# Altium schematic sheet FETs.SchDoc
size 259 x 167 mm; SheetNumber: 2; SheetTotal: 8
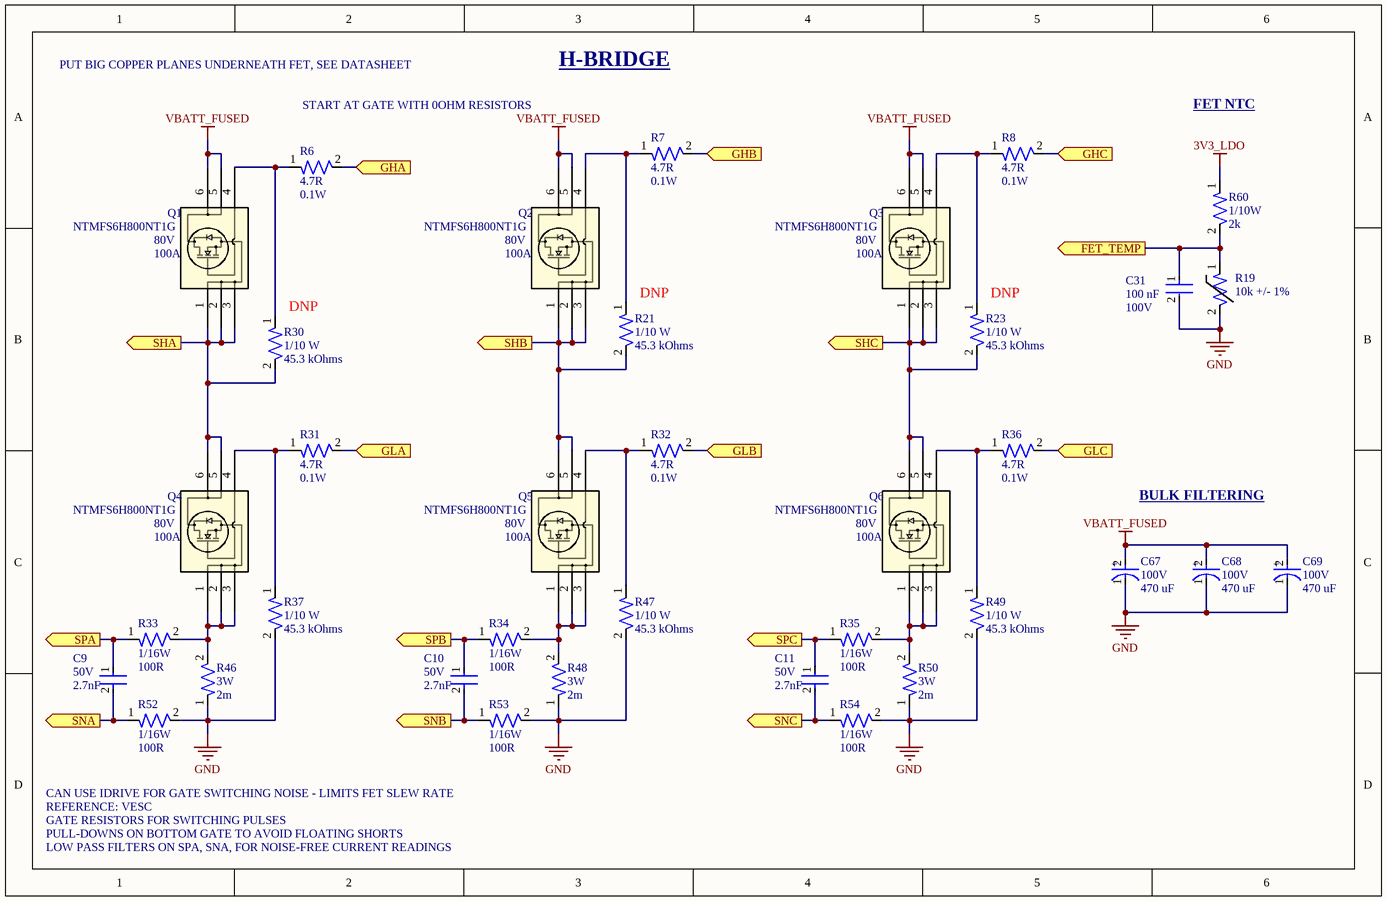
[diagram p0: FETs.SchDoc]

## Parts
C9  Voltage: 50V  Capacitance: 2.7nF  [CAP-0805]  (hidden comment: GRM2165C1H272JA01D)
C10  Voltage: 50V  Capacitance: 2.7nF  [CAP-0805]  (hidden comment: GRM2165C1H272JA01D)
C11  Voltage: 50V  Capacitance: 2.7nF  [CAP-0805]  (hidden comment: GRM2165C1H272JA01D)
C31  Capacitance: 100 nF  Voltage: 100V  [CAP-0603]  (hidden comment: GRM188R72A104KA35D)
C67  Voltage: 100V  Capacitance: 470 uF  [CAP-470U-0001]  (hidden comment: ESH477M100AM2AA)
C68  Voltage: 100V  Capacitance: 470 uF  [CAP-470U-0001]  (hidden comment: ESH477M100AM2AA)
C69  Voltage: 100V  Capacitance: 470 uF  [CAP-470U-0001]  (hidden comment: ESH477M100AM2AA)
Q1  NTMFS6H800NT1G  Vdss: 80V  Drain Current: 100A  [DFN6_5X6_SO8FL_488AA_ONS]
Q2  NTMFS6H800NT1G  Vdss: 80V  Drain Current: 100A  [DFN6_5X6_SO8FL_488AA_ONS]
Q3  NTMFS6H800NT1G  Vdss: 80V  Drain Current: 100A  [DFN6_5X6_SO8FL_488AA_ONS]
Q4  NTMFS6H800NT1G  Vdss: 80V  Drain Current: 100A  [DFN6_5X6_SO8FL_488AA_ONS]
Q5  NTMFS6H800NT1G  Vdss: 80V  Drain Current: 100A  [DFN6_5X6_SO8FL_488AA_ONS]
Q6  NTMFS6H800NT1G  Vdss: 80V  Drain Current: 100A  [DFN6_5X6_SO8FL_488AA_ONS]
R6  Resistance: 4.7R  Power: 0.1W  [RES-0603]  (hidden comment: RMCF0603FT4R70)
R7  Resistance: 4.7R  Power: 0.1W  [RES-0603]  (hidden comment: RMCF0603FT4R70)
R8  Resistance: 4.7R  Power: 0.1W  [RES-0603]  (hidden comment: RMCF0603FT4R70)
R19  Resistance: 10k +/- 1%  [RES-0603]  (hidden comment: NCU18XH103F60RB)
R21  Power: 1/10 W  Resistance: 45.3 kOhms  [RES-0603]  (hidden comment: RC0603FR-0745K3L)
R23  Power: 1/10 W  Resistance: 45.3 kOhms  [RES-0603]  (hidden comment: RC0603FR-0745K3L)
R30  Power: 1/10 W  Resistance: 45.3 kOhms  [RES-0603]  (hidden comment: RC0603FR-0745K3L)
R31  Resistance: 4.7R  Power: 0.1W  [RES-0603]  (hidden comment: RMCF0603FT4R70)
R32  Resistance: 4.7R  Power: 0.1W  [RES-0603]  (hidden comment: RMCF0603FT4R70)
R33  Power: 1/16W  Resistance: 100R  [RES-0402]  (hidden comment: RC0402FR-07100RL)
R34  Power: 1/16W  Resistance: 100R  [RES-0402]  (hidden comment: RC0402FR-07100RL)
R35  Power: 1/16W  Resistance: 100R  [RES-0402]  (hidden comment: RC0402FR-07100RL)
R36  Resistance: 4.7R  Power: 0.1W  [RES-0603]  (hidden comment: RMCF0603FT4R70)
R37  Power: 1/10 W  Resistance: 45.3 kOhms  [RES-0603]  (hidden comment: RC0603FR-0745K3L)
R46  Power: 3W  Resistance: 2m  [STA_CSNL25122_STP]  (hidden comment: CSNL2512FT2L00)
R47  Power: 1/10 W  Resistance: 45.3 kOhms  [RES-0603]  (hidden comment: RC0603FR-0745K3L)
R48  Power: 3W  Resistance: 2m  [STA_CSNL25122_STP]  (hidden comment: CSNL2512FT2L00)
R49  Power: 1/10 W  Resistance: 45.3 kOhms  [RES-0603]  (hidden comment: RC0603FR-0745K3L)
R50  Power: 3W  Resistance: 2m  [STA_CSNL25122_STP]  (hidden comment: CSNL2512FT2L00)
R52  Power: 1/16W  Resistance: 100R  [RES-0402]  (hidden comment: RC0402FR-07100RL)
R53  Power: 1/16W  Resistance: 100R  [RES-0402]  (hidden comment: RC0402FR-07100RL)
R54  Power: 1/16W  Resistance: 100R  [RES-0402]  (hidden comment: RC0402FR-07100RL)
R60  Power: 1/10W  Resistance: 2k  [RES-0603]  (hidden comment: RC0603JR-072KL)

## Ports
FET_TEMP (out, see MCU[1B], MCU[4D]), GHA (in, see Driver[4C]), GHB (in, see Driver[4B]), GHC (in, see Driver[4B]), GLA (in, see Driver[4C]), GLB (in, see Driver[4B]), GLC (in, see Driver[4B]), SHA (out, see Connectors[4B], Driver[4C]), SHB (out, see Connectors[4B], Driver[4B]), SHC (out, see Connectors[4B], Driver[4B]), SNA (out, see Driver[4B]), SNB (out, see Driver[4B]), SNC (out, see Driver[4B]), SPA (out, see Driver[4B]), SPB (out, see Driver[4B]), SPC (out, see Driver[4B])

## Nets
3V3_LDO: R60.1
GND: C31.2 C67.1 C68.1 C69.1 R19.2 R37.2 R46.1 R47.2 R48.1 R49.2 R50.1 R52.2 R53.2 R54.2
VBATT_FUSED: C67.2 C68.2 C69.2 Q1.5 Q1.6 Q2.5 Q2.6 Q3.5 Q3.6
FET_TEMP: C31.1 R19.1 R60.2 ; port FET_TEMP
GHA: R6.2 ; port GHA
GHB: R7.2 ; port GHB
GHC: R8.2 ; port GHC
GLA: R31.2 ; port GLA
GLB: R32.2 ; port GLB
GLC: R36.2 ; port GLC
SHA: Q1.1 Q1.2 Q1.3 Q4.5 Q4.6 R30.2 ; port SHA
SHB: Q2.1 Q2.2 Q2.3 Q5.5 Q5.6 R21.2 ; port SHB
SHC: Q3.1 Q3.2 Q3.3 Q6.5 Q6.6 R23.2 ; port SHC
SNA: C9.2 R52.1 ; port SNA
SNB: C10.2 R53.1 ; port SNB
SNC: C11.2 R54.1 ; port SNC
SPA: C9.1 R33.1 ; port SPA
SPB: C10.1 R34.1 ; port SPB
SPC: C11.1 R35.1 ; port SPC
NetQ1_4: Q1.4 R6.1 R30.1
NetQ2_4: Q2.4 R7.1 R21.1
NetQ3_4: Q3.4 R8.1 R23.1
NetQ4_1: Q4.1 Q4.2 Q4.3 R33.2 R46.2
NetQ4_4: Q4.4 R31.1 R37.1
NetQ5_1: Q5.1 Q5.2 Q5.3 R34.2 R48.2
NetQ5_4: Q5.4 R32.1 R47.1
NetQ6_1: Q6.1 Q6.2 Q6.3 R35.2 R50.2
NetQ6_4: Q6.4 R36.1 R49.1

## Notes on the sheet
- PUT BIG COPPER PLANES UNDERNEATH FET, SEE DATASHEET
- START AT GATE WITH 0OHM RESISTORS
- H-BRIDGE
- FET NTC
- (near R30) DNP
- (near R21) DNP
- (near R23) DNP
- BULK FILTERING
- CAN USE IDRIVE FOR GATE SWITCHING NOISE - LIMITS FET SLEW RATE
- REFERENCE: VESC
- GATE RESISTORS FOR SWITCHING PULSES
- PULL-DOWNS ON BOTTOM GATE TO AVOID FLOATING SHORTS
- LOW PASS FILTERS ON SPA, SNA, FOR NOISE-FREE CURRENT READINGS
- (in symbol CAP-470U-0001) +

## Library data of the parts
C9-C11 = CAP-2.7N-0001: CAP CER 2700PF 50V C0G/NP0 0805; ComponentLink1Description: Datasheet; ComponentLink1URL: https://search.murata.co.jp/Ceramy/image/img/A01X/G101/ENG/GRM2165C1H272JA01-01.pdf; Device Class: Ceramic; Size: 0805
C31 = CAP-1U-0002: CAP CER 100NF 100V X7R 0603; Device Class: Ceramic; Size: 0603
C67-C69 = CAP-470U-0001: CAP ALUM 470UF 20% 100V RADIAL; Device Class: Electrolytic; ComponentLink1Description: Datasheet; ComponentLink1URL: https://industrial.panasonic.com/cdbs/www-data/pdf/RDE0000/ABA0000C1190.pdf
Q1-Q6 = NTMFS6H800NT1G: N-Channel 80 V 28A (Ta), 203A (Tc) 3.8W (Ta), 200W (Tc) Surface Mount 5-DFN (5x6) (8-SOFL); Manufacturer_Part_Number: TPH2R506PL; Vgs (max): 20V; Vgs: 4V @ 1mA; RefDes: RefDes
R6-R8 R31 R32 R36 = RES-4.7-0001: 4.7 Ohms ±1% 0.1W, 1/10W Chip Resistor 0603 (1608 Metric) Automotive AEC-Q200 Thick Film; Tolerance: 1%; Size: 0402; ComponentLink1Description: Datasheet; ComponentLink1URL: https://www.yageo.com/upload/media/product/products/datasheet/rchip/PYu-RC_Group_51_RoHS_L_12.pdf
R19 = THERM-10K-0001: NTC Thermistor 10k 0603 (1608 Metric); Manufacturer Part Number: TMP6431DECR; Manufacturer: Texas Instruments; Package Size: 0402
R21 R23 R30 R37 R47 R49 = RES-45.3K-0001: 45.3 kOhms ±1% 0.1W, 1/10W Chip Resistor 0603 (1608 Metric) Moisture Resistant Thick Film; Tolerance: +/- 1%; Assembled?: no; Package Size: 0603
R33-R35 R52-R54 = RES-100-0001: RES 100 OHM 1% 1/16W 0402; Tolerance: 1%; Size: 0402; ComponentLink1Description: Datasheet; ComponentLink1URL: https://www.yageo.com/upload/media/product/products/datasheet/rchip/PYu-RC_Group_51_RoHS_L_12.pdf
R46 R48 R50 = RES-2m-0001: 2 mOhms ±1% 3W Chip Resistor 2512 (6332 Metric) Current Sense, Moisture Resistant Metal Element; Tolerance: 1%; Size: 0402; ComponentLink1Description: Datasheet; ComponentLink1URL: https://www.yageo.com/upload/media/product/products/datasheet/rchip/PYu-RC_Group_51_RoHS_L_12.pdf
R60 = RES-13.7K-0001: RES 2K OHM 5% 1/10W 0603